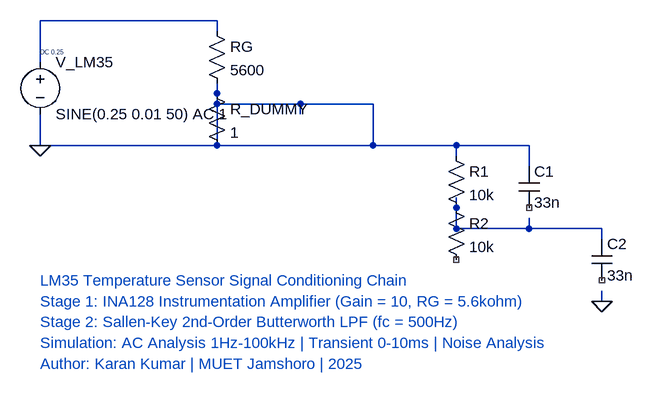
[diagram p0: schematic full_afe_chain.asc]
full_afe_chain.asc, the LTspice schematic file:
Version 4
SHEET 1 2480 1264
WIRE 80 80 -64 80
WIRE 208 80 80 80
WIRE 208 96 208 80
WIRE -64 144 -64 80
WIRE 208 208 208 176
WIRE 336 208 208 208
WIRE 448 208 336 208
WIRE 336 224 336 208
WIRE -64 272 -64 224
WIRE 208 272 208 208
WIRE 208 272 -64 272
WIRE 448 272 448 208
WIRE 448 272 208 272
WIRE 576 272 448 272
WIRE 688 272 576 272
WIRE 576 288 576 272
WIRE 688 304 688 272
WIRE 576 368 576 352
WIRE 688 400 688 384
WIRE 576 400 576 368
WIRE 576 400 688 400
WIRE 800 400 576 400
WIRE 800 416 800 400
WIRE 800 512 800 496
FLAG -64 272 0
FLAG 800 512 0
SYMBOL voltage -64 128 R0
WINDOW 123 0 0 Left 0
WINDOW 39 0 0 Left 0
SYMATTR InstName V_LM35
SYMATTR Value SINE(0.25 0.01 50) AC 1
SYMATTR Value2 DC 0.25
SYMBOL res 192 80 R0
SYMATTR InstName RG
SYMATTR Value 5600
SYMBOL res 192 176 R0
SYMATTR InstName R_DUMMY
SYMATTR Value 1
SYMBOL res 560 272 R0
SYMATTR InstName R1
SYMATTR Value 10k
SYMBOL res 560 352 R0
SYMATTR InstName R2
SYMATTR Value 10k
SYMBOL cap 672 304 R0
SYMATTR InstName C1
SYMATTR Value 33n
SYMBOL cap 784 416 R0
SYMATTR InstName C2
SYMATTR Value 33n
TEXT -64 480 Left 2 ;LM35 Temperature Sensor Signal Conditioning Chain
TEXT -64 512 Left 2 ;Stage 1: INA128 Instrumentation Amplifier (Gain = 10, RG = 5.6kohm)
TEXT -64 544 Left 2 ;Stage 2: Sallen-Key 2nd-Order Butterworth LPF (fc = 500Hz)
TEXT -64 576 Left 2 ;Simulation: AC Analysis 1Hz-100kHz | Transient 0-10ms | Noise Analysis
TEXT -64 608 Left 2 ;Author: Karan Kumar | MUET Jamshoro | 2025

The netlist it stands for:
* full_afe_chain.asc
V_LM35 N001 0 SINE(0.25 0.01 50) AC 1 DC 0.25
RG N001 0 5600
R_DUMMY 0 0 1
R1 0 N002 10k
R2 N002 NC_01 10k
C1 0 NC_02 33n
C2 N002 NC_03 33n
* LM35 Temperature Sensor Signal Conditioning Chain
* Stage 1: INA128 Instrumentation Amplifier (Gain = 10, RG = 5.6kohm)
* Stage 2: Sallen-Key 2nd-Order Butterworth LPF (fc = 500Hz)
* Simulation: AC Analysis 1Hz-100kHz | Transient 0-10ms | Noise Analysis
* Author: Karan Kumar | MUET Jamshoro | 2025
.backanno
.end